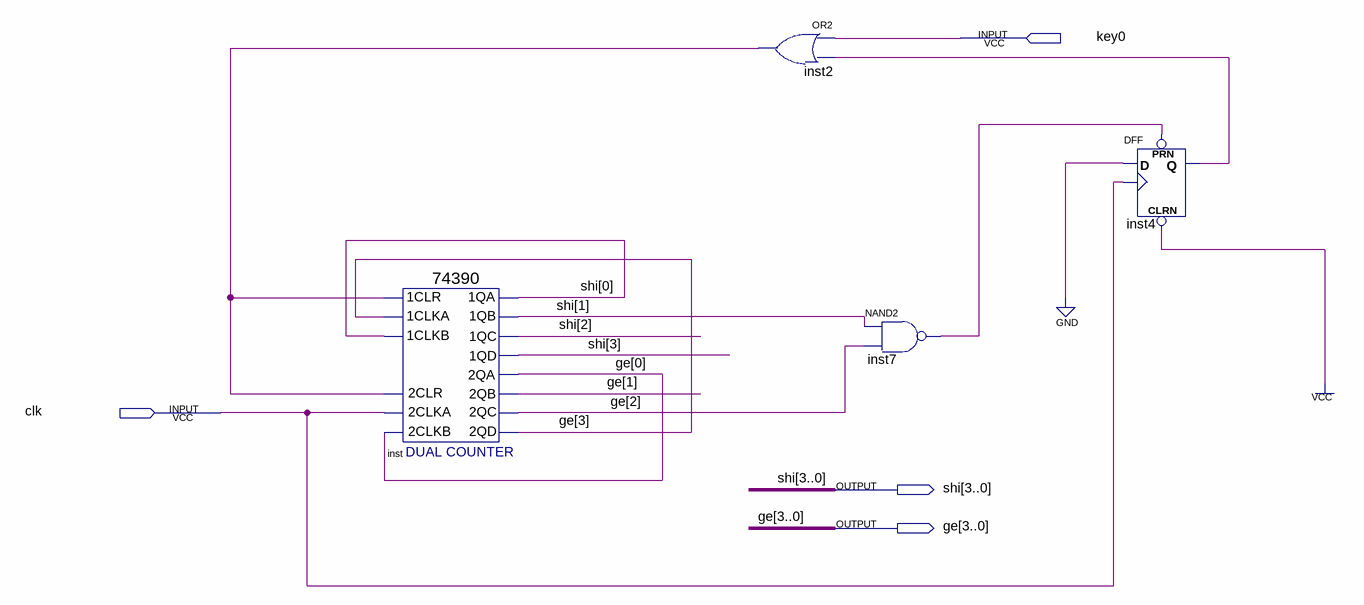
[diagram p0: schematic sheet]
// Quartus schematic cnt24.bdf as structural Verilog: 4 symbols, 4 pins
module cnt24 (
  input  key0,
  input  clk,
  output [3:0] shi,
  output [3:0] ge
);

  wire inst2_out, inst4_q, inst7_out;

  \74390  inst (
    .\2CLKA (clk), .\2CLR (inst2_out), .\2CLKB (ge[0]), .\1CLR (inst2_out), .\1CLKA (ge[3]),
    .\1CLKB (shi[0]), .\1QA (shi[0]), .\1QB (shi[1]), .\1QC (shi[2]), .\1QD (shi[3]), .\2QA (ge[0]),
    .\2QB (ge[1]), .\2QC (ge[2]), .\2QD (ge[3]));
  or inst2 (inst2_out, key0, inst4_q);
  nand inst7 (inst7_out, shi[1], ge[2]);
  DFF inst4 (.CLRN(1'b1), .CLK(clk), .D(1'b0), .PRN(inst7_out), .Q(inst4_q));
endmodule
